# EasyEDA Pro project 装甲板灯板.eprj

# Schematic Schematic1
Board Name: Board1; Create Date: 2025-10-24; Page Name: P1; Project Name: 装甲板灯板; Schematic Name: Schematic1; Update Date: 2025-10-24; Company: 嘉立创EDA; Page Size: A4; Version: V1.0
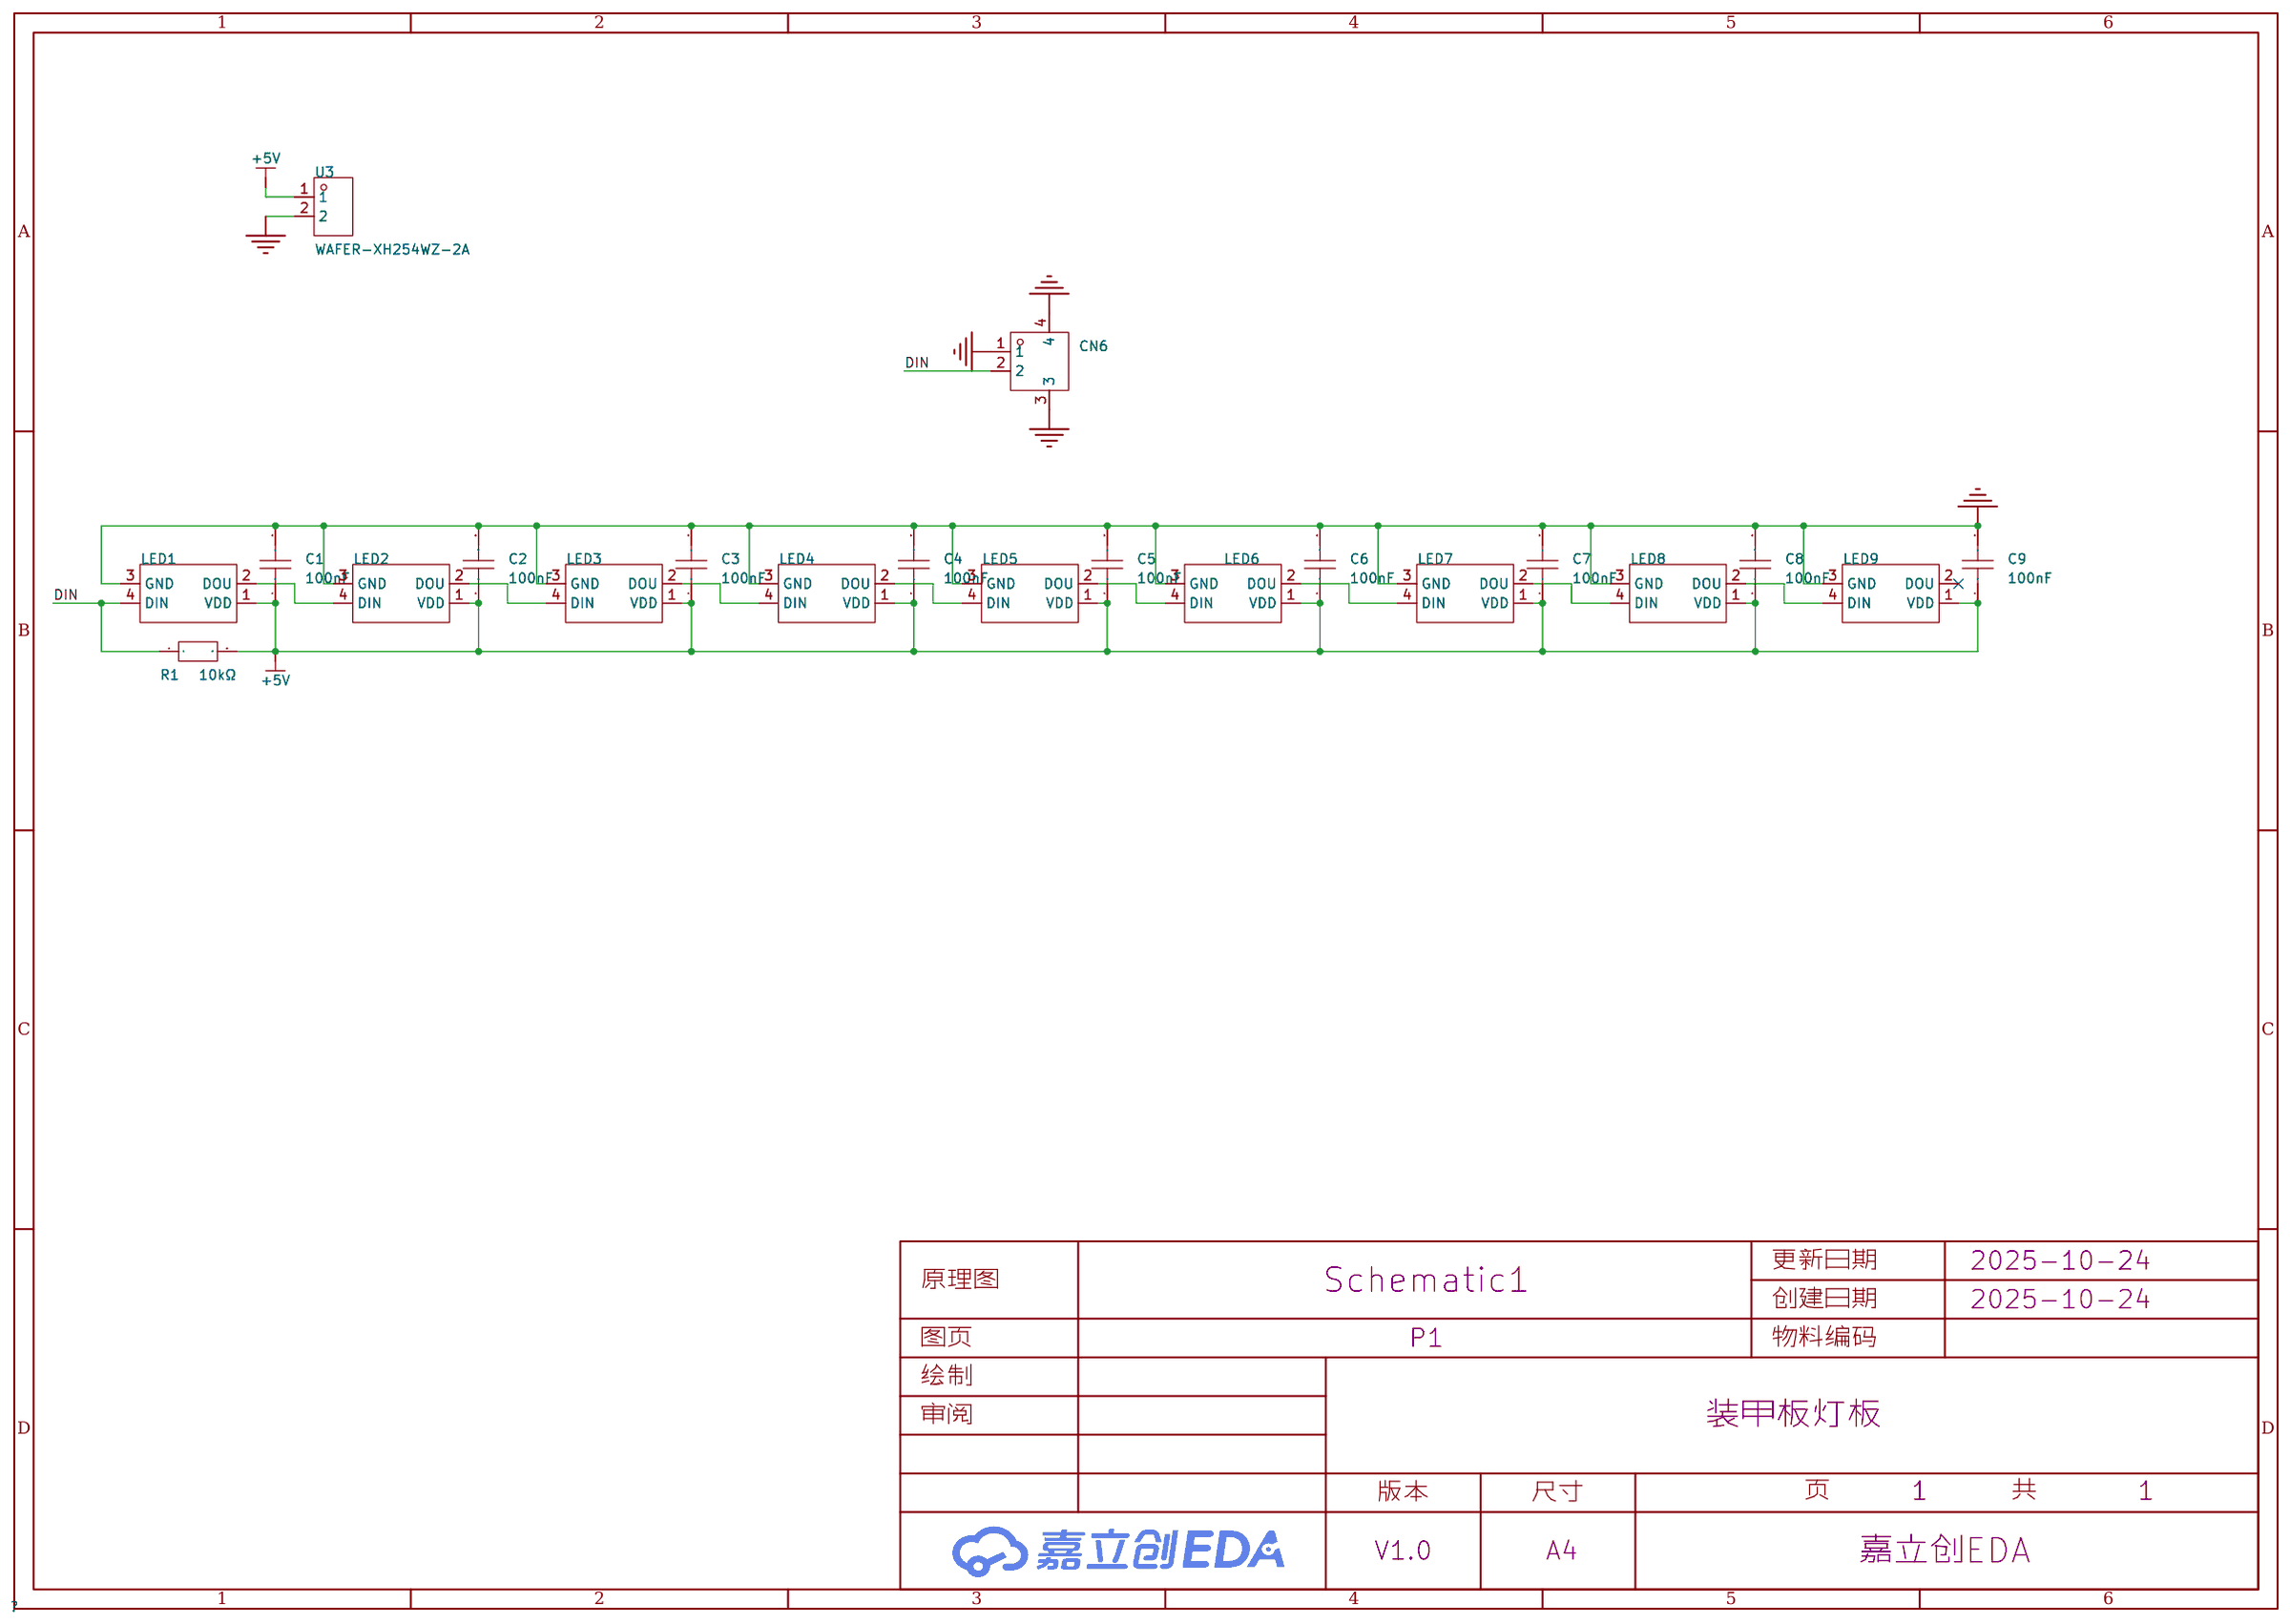
[diagram p0: schematic sheet]

## Parts
C1  100nF  [C0603]
C2  100nF  [C0603]
C3  100nF  [C0603]
C4  100nF  [C0603]
C5  100nF  [C0603]
C6  100nF  [C0603]
C7  100nF  [C0603]
C8  100nF  [C0603]
C9  100nF  [C0603]
CN6  X1251WVS-02HF-LPSW  [郭哥CAN2脚母接口]
LED1  XL-5050RGBC-2812B  [LED-SMD_4P-L5.0-W5.0-BL_XL-5050RGBC]
LED2  XL-5050RGBC-2812B  [LED-SMD_4P-L5.0-W5.0-BL_XL-5050RGBC]
LED3  XL-5050RGBC-2812B  [LED-SMD_4P-L5.0-W5.0-BL_XL-5050RGBC]
LED4  XL-5050RGBC-2812B  [LED-SMD_4P-L5.0-W5.0-BL_XL-5050RGBC]
LED5  XL-5050RGBC-2812B  [LED-SMD_4P-L5.0-W5.0-BL_XL-5050RGBC]
LED6  XL-5050RGBC-2812B  [LED-SMD_4P-L5.0-W5.0-BL_XL-5050RGBC]
LED7  XL-5050RGBC-2812B  [LED-SMD_4P-L5.0-W5.0-BL_XL-5050RGBC]
LED8  XL-5050RGBC-2812B  [LED-SMD_4P-L5.0-W5.0-BL_XL-5050RGBC]
LED9  XL-5050RGBC-2812B  [LED-SMD_4P-L5.0-W5.0-BL_XL-5050RGBC]
R1  10kΩ  [R0603]
U3  WAFER-XH254WZ-2A  [CONN-TH_2P-P2.50_WAFER-XH254WZ-2A]

## Library data of the parts
C1-C9 = NL0603B104M500CPBN: LCSC Part Name: 100nF ±20% 50V; Supplier Part: C45369465; Manufacturer: HUI JU(汇聚); Supplier Footprint: 0603; Datasheet: https://item.szlcsc.com/datasheet/NL0603B104M500CPBN/47466580.html; Supplier: LCSC; Tolerance: ±20%; Voltage Rating: 50V
CN6 = X1251WVS-02HF-LPSW: Supplier: LCSC; Supplier Part: C388714; Manufacturer: XKB Enterprise
LED1-LED9 = XL-5050RGBC-2812B: LCSC Part Name: XL-5050RGBC-WS2812B; Supplier Part: C2843785; Manufacturer: XINGLIGHT(成兴光); Supplier Footprint: SMD5050-4P; JLCPCB Part Class: 扩展库; Datasheet: https://item.szlcsc.com/datasheet/XL-5050RGBC-2812B/3033136.html; Supplier: LCSC; Wavelength: 465nm~475nm；620nm~635nm；520nm~535nm; Luminous Intensity: R:500mcd~700mcd；B:300mcd~500mcd；G:1300mcd~1800mcd; Fixed-Frequency Pwm Mode: 4kHz; Data Transmission Rate: 800Kbit/s; Voltage - Supply: 3.5V~5.5V; Quiescent Current: 0.3mA; Lens Color: 无色透明透镜; ESD Withstand Voltage: 2000V; Installation method: 正贴; Operating Temperature: -20℃~+85℃; Viewing Angle: 120°; Length: 5mm; Width: 1.6mm; Height: 5mm
R1 = TC0350B1002T5F: LCSC Part Name: 10kΩ ±0.1% 100mW 薄膜电阻; Supplier Part: C2989264; Manufacturer: UNI-ROYAL(厚声); Supplier Footprint: 0603; JLCPCB Part Class: 扩展库; Datasheet: https://item.szlcsc.com/datasheet/TC0350B1002T5F/3448687.html; Supplier: LCSC; Type: 薄膜电阻; Tolerance: ±0.1%; Power(Watts): 100mW; Voltage-Supply(Max): 75V; Temperature Coefficient: ±50ppm/℃; Operating Temperature: -55℃~+155℃
U3 = WAFER-XH254WZ-2A: 插针结构:1x2P;间距:2.54mm;安装方式:弯插;参考系列:XH;总PIN数:2P;排数:1;每排PIN数:2;额定电流:3A;触头材质:黄铜;工作温度:-25℃~+85℃;; LCSC Part Name: 1x2P 间距:2.54mm 弯插 系列:XH; Supplier Part: C7432691; Manufacturer: HANBO(汉博); Supplier Footprint: 插件,P=2.5mm; JLCPCB Part Class: 扩展库; Datasheet: https://item.szlcsc.com/datasheet/WAFER-XH254WZ-2A/8437688.html; Supplier: LCSC; Pins Structure: 1x2P; Pitch: 2.54mm; Mounting Type: 弯插; Reference Series: XH; Number of Pins: 2P; Number of Rows: 1; Number of PINs Per Row: 2; Current Rating: 3A; Contact Material: 黄铜; Operating Temperature: -25℃~+85℃; Voltage Rating: 250V; Plastic Material: PA66; Flame Retardant Rating: UL94V-0

## Nets
+5V: C1.1 C2.1 C3.1 C4.1 C5.1 C6.1 C7.1 C8.1 C9.1 LED1.1(VDD) LED2.1(VDD) LED3.1(VDD) LED4.1(VDD) LED5.1(VDD) LED6.1(VDD) LED7.1(VDD) LED8.1(VDD) LED9.1(VDD) R1.2 U3.1
GND: C1.2 C2.2 C3.2 C4.2 C5.2 C6.2 C7.2 C8.2 C9.2 CN6.1 CN6.3 CN6.4 LED1.3(GND) LED2.3(GND) LED3.3(GND) LED4.3(GND) LED5.3(GND) LED6.3(GND) LED7.3(GND) LED8.3(GND) LED9.3(GND) U3.2
DIN: CN6.2 LED1.4(DIN) R1.1
$1N621: LED1.2(DOU) LED2.4(DIN)
$1N627: LED2.2(DOU) LED3.4(DIN)
$1N634: LED3.2(DOU) LED4.4(DIN)
$1N641: LED4.2(DOU) LED5.4(DIN)
$1N648: LED5.2(DOU) LED6.4(DIN)
$1N655: LED6.2(DOU) LED7.4(DIN)
$1N662: LED7.2(DOU) LED8.4(DIN)
Net-(LED8-2): LED8.2(DOU) LED9.4(DIN)

Not connected (* = marked no-connect by the designer): LED9 2(DOU)*

# Board PCB1
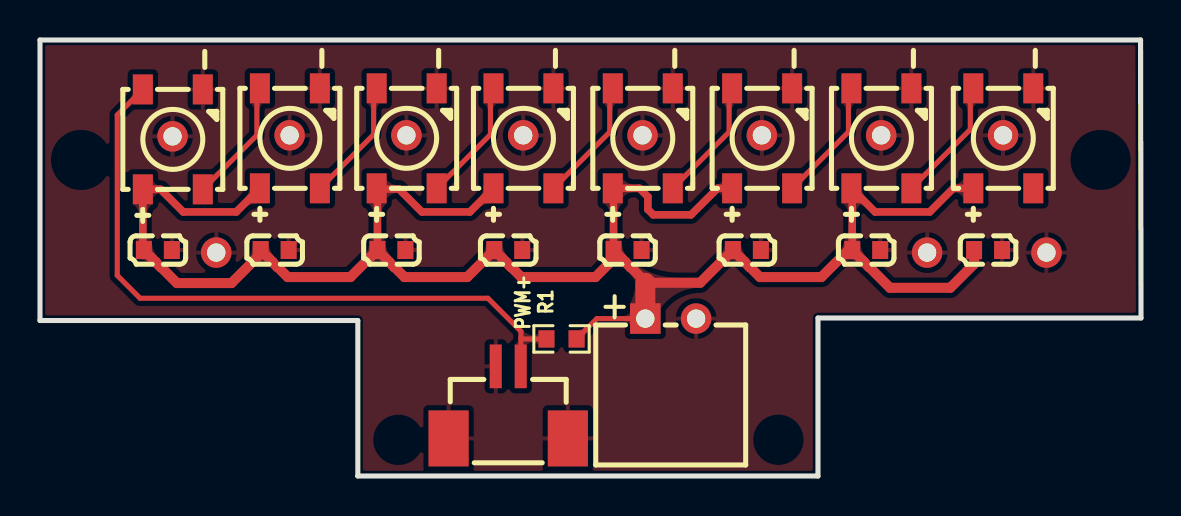
[diagram p1: board, top side]
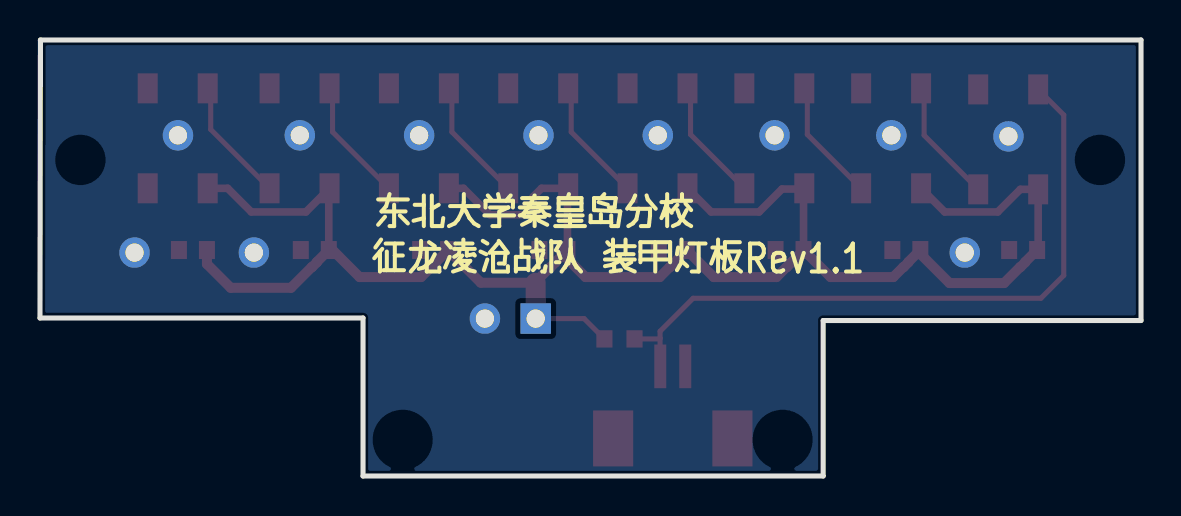
[diagram p2: board, bottom side, seen from below]

Outline 55.08 x 21.81 mm; copper layers: Top Layer, Bottom Layer. Coordinates in mm from the lower left corner of the outline.
Outline path: 0,21.81 0,7.78 15.9,7.78 15.9,0 38.92,0 38.92,7.91 55.08,7.91 55.06,21.81 0,21.81
Stack: Top Layer 0.035mm / Dielectric1 1.51mm FR4 er 4.5 / Bottom Layer 0.035mm

## Design rules (mm)
template: 自定义配置
spacing copperThickness1oz (default): track to track 0.102, other pairs 0.152 to 0.3
spacing copperThickness2oz: track to track 0.203, other pairs 0.152 to 0.3
track width copperThickness1oz (default): min 0.127, default 0.254, max 2.54
track width copperThickness2oz: min 0.203, default 0.254, max 2.54
differential pair differentialPair (default): width min 0.127, default 0.254, max 2.54; gap min 0.152, default 0.152
via viaSize (default): diameter min 0.5, default 0.61, max 10; hole min 0.3, default 0.305, max 6.3
pour e257 uses copperRegion1

## Placement (name value [footprint] x y rotation side)
C1  100nF  [C0603]  41.33 11.3 0 top
C2  100nF  [C0603]  5.9 11.3 0 top
C3  100nF  [C0603]  11.74 11.3 0 top
C4  100nF  [C0603]  17.58 11.3 0 top
C5  100nF  [C0603]  23.42 11.3 0 top
C6  100nF  [C0603]  29.39 11.3 0 top
C7  100nF  [C0603]  35.36 11.3 0 top
C8  100nF  [C0603]  47.43 11.3 0 top
CN6  X1251WVS-02HF-LPSW  [郭哥CAN2脚母接口]  23.42 3.56 0 top
LED1  XL-5050RGBC-2812B  [LED-SMD_4P-L5.0-W5.0-BL_XL-5050RGBC]  6.64 16.84 0 top
LED2  XL-5050RGBC-2812B  [LED-SMD_4P-L5.0-W5.0-BL_XL-5050RGBC]  12.5 16.89 0 top
LED3  XL-5050RGBC-2812B  [LED-SMD_4P-L5.0-W5.0-BL_XL-5050RGBC]  18.34 16.89 0 top
LED4  XL-5050RGBC-2812B  [LED-SMD_4P-L5.0-W5.0-BL_XL-5050RGBC]  24.19 16.89 0 top
LED5  XL-5050RGBC-2812B  [LED-SMD_4P-L5.0-W5.0-BL_XL-5050RGBC]  30.15 16.89 0 top
LED6  XL-5050RGBC-2812B  [LED-SMD_4P-L5.0-W5.0-BL_XL-5050RGBC]  36.12 16.89 0 top
LED7  XL-5050RGBC-2812B  [LED-SMD_4P-L5.0-W5.0-BL_XL-5050RGBC]  42.09 16.89 0 top
LED8  XL-5050RGBC-2812B  [LED-SMD_4P-L5.0-W5.0-BL_XL-5050RGBC]  48.19 16.89 0 top
NOREF  -  [Pad_e590]  42.08 17.04 0 top
NOREF#2  -  [Pad_e589]  36.11 17.04 0 top
NOREF#3  -  [Pad_e588]  30.14 17.04 0 top
NOREF#4  -  [Pad_e577]  8.82 11.18 0 top
NOREF#5  -  [Pad_e585]  12.49 17.04 0 top
NOREF#6  -  [Pad_e586]  18.33 17.04 0 top
NOREF#7  -  [Pad_e591]  48.18 17.04 0 top
NOREF#8  -  [Pad_e582]  44.38 11.18 0 top
NOREF#9  -  [Pad_e584]  6.63 16.99 0 top
NOREF#10  -  [Pad_e583]  50.35 11.18 0 top
NOREF#11  -  [Pad_e587]  24.17 17.04 0 top
R1  10kΩ  [R0603]  26.09 6.86 0 top
U3  WAFER-XH254WZ-2A  [CONN-TH_2P-P2.50_WAFER-XH254WZ-2A]  31.55 7.87 0 top

## Footprints (pads in the part's own frame, mm; a bottom-side part is the same pattern mirrored in y, then rotated)
C0603
  rect 0.8x0.9 smd: 1(-0.7,0) 2(0.7,0)
CONN-TH_2P-P2.50_WAFER-XH254WZ-2A
  rect 1.524x1.524 hole 0.914: 1(-1.27,0)
  round 1.524 hole 0.914: 2(1.27,0)
LED-SMD_4P-L5.0-W5.0-BL_XL-5050RGBC
  rect 1x1.5 smd: 1(-1.5,-2.5) 2(1.5,-2.5) 3(1.5,2.5) 4(-1.5,2.5)
Pad_e577
  round 1.524 hole 0.914: 1(0,0)
Pad_e582
  round 1.524 hole 0.914: 1(0,0)
Pad_e583
  round 1.524 hole 0.914: 1(0,0)
Pad_e584
  round 1.524 hole 0.914: 1(0,0)
Pad_e585
  round 1.524 hole 0.914: 1(0,0)
Pad_e586
  round 1.524 hole 0.914: 1(0,0)
Pad_e587
  round 1.524 hole 0.914: 1(0,0)
Pad_e588
  round 1.524 hole 0.914: 1(0,0)
Pad_e589
  round 1.524 hole 0.914: 1(0,0)
Pad_e590
  round 1.524 hole 0.914: 1(0,0)
Pad_e591
  round 1.524 hole 0.914: 1(0,0)
R0603
  rect 0.806x0.864 smd: 1(-0.753,0) 2(0.753,0)
郭哥CAN2脚母接口
  rect 0.6x2.184 smd: 1(-0.625,1.929) 2(0.625,1.929)
  rect 2.006x2.8 smd: 3(2.983,-1.675) 4(-2.983,-1.675)

## Nets
As in the schematic, except:
GND: C1.2 C2.2 C3.2 C4.2 C5.2 C6.2 C7.2 C8.2 CN6.1 CN6.3 CN6.4 LED1.3 LED2.3 LED3.3 LED4.3 LED5.3 LED6.3 LED7.3 LED8.3 NOREF.1 NOREF#2.1 NOREF#3.1 NOREF#4.1 NOREF#5.1 NOREF#6.1 NOREF#7.1 NOREF#8.1 NOREF#9.1 NOREF#10.1 NOREF#11.1 U3.2

## Routing (per net, layer and track width the routed paths; a pad name or vN(x,y) marks a point on that pad's centre or on a via; arc(x,y) is an arc through that point)
+5V: length 97.2
  Top Layer w0.254: U3.1 27.86,7.87 R1.2
  Top Layer w0.381: LED6.1 33.89,14.39 32.57,13.07 30.68,13.07 30.41,13.34 30.41,13.97 29.99,14.39 LED5.1 28.69,14.35 C6.1 ; LED4.1 21.5,13.21 19.11,13.21 17.96,14.35 16.88,14.35 ; C1.1 40.63,14.35 ; 40.63,14.35 41.78,13.21 44.5,13.21 45.69,14.39 LED8.1 ; 40.63,14.35 LED7.1 ; LED2.1 9.82,13.21 7.17,13.21 6.04,14.34 LED1.1 5.14,11.36 C2.1 ; 16.88,14.35 LED3.1 ; 16.88,14.35 C4.1
  Top Layer w0.5: C8.1 46.73,10.6 45.54,9.41 42.52,9.41 41.48,10.45 41.46,10.45 41.23,10.69 41.23,10.7 C1.1 40.44,11.3 39.09,9.95 36.01,9.95 35.51,10.45 35.49,10.45 35.26,10.69 35.26,10.7 C7.1 33.03,9.67 30.33,9.67 29.54,10.45 29.53,10.45 29.29,10.69 29.29,10.7 C6.1 28.69,10.86 27.79,9.95 24.08,9.95 23.58,10.45 23.56,10.45 23.32,10.69 23.32,10.7 C5.1 21.37,9.95 18.23,9.95 17.73,10.45 17.71,10.45 17.48,10.69 17.48,10.7 C4.1 15.53,9.95 12.39,9.95 11.89,10.45 11.87,10.45 11.64,10.69 11.64,10.7 C3.1 11.04,11.11 9.58,9.65 6.85,9.65 6.05,10.45 6.03,10.45 5.8,10.69 5.8,10.7 C2.1
  Top Layer w1: U3.1 30.28,9.67
DIN: length 34.2
  Top Layer w0.254: 24.06,6.89 24.06,7.24 22.41,8.89 5.01,8.89 3.87,10.03 3.87,18.06 LED1.4 ; 24.06,6.89 24.06,5.5 CN6.2 ; 24.06,6.89 24.09,6.86 R1.1
$1N621: length 6.2
  Top Layer w0.254: LED2.4 10.85,19.24 10.85,17.04 LED1.2
$1N627: length 6.2
  Top Layer w0.254: LED2.2 16.69,17.08 16.69,19.24 LED3.4
$1N634: length 6.2
  Top Layer w0.254: LED4.4 22.53,19.24 22.53,17.08 LED3.2
$1N641: length 6.2
  Top Layer w0.254: LED4.2 28.5,17.21 28.5,19.24 LED5.4
$1N648: length 6.2
  Top Layer w0.254: LED6.4 34.47,19.24 34.47,17.21 LED5.2
$1N655: length 6.2
  Top Layer w0.254: LED7.4 40.44,19.24 40.44,17.21 LED6.2
$1N662: length 6.3
  Top Layer w0.254: LED7.2 46.54,17.34 46.54,19.24 LED8.4

## Copper pours and planes (outline as drawn; the poured copper is in the pictures)
GND on Top Layer: -1.85,25.91 60.89,25.91 60.89,-9.27 -1.85,-9.27
GND on Bottom Layer: -1.72,27.05 59.36,27.05 59.36,-2.54 -1.72,-2.54

Small or netless copper shapes (teardrops, artwork), in the pictures only: 53 on Top Layer

## Text on the board
Bottom Silkscreen Layer: 征龙凌沧战队 装甲灯板Rev1.1 | 东北大学秦皇岛分校
Top Silkscreen Layer: PWM+ | +
